# Altium project Master_Test_Board.PrjPcb
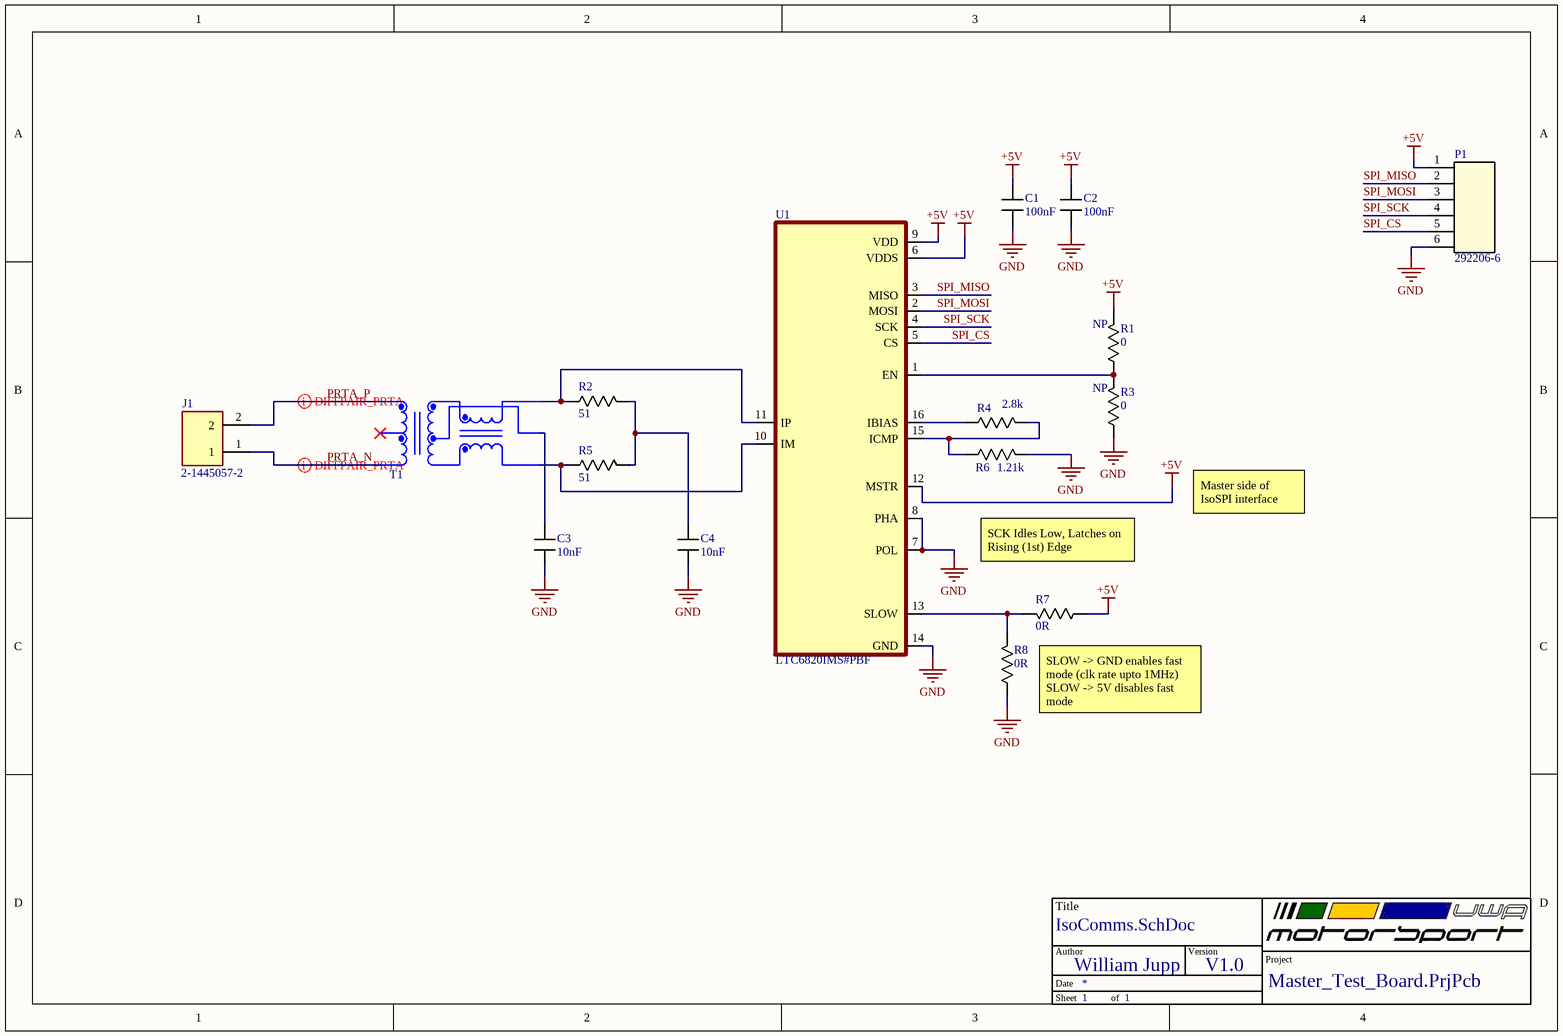
[diagram p0: IsoComms.SchDoc]
ProAuthor: William Jupp; Version: V1.0
1 sheet, 17 parts. Net scope: global (net labels, ports and power ports of the same name join across sheets).

## Sheet IsoComms.SchDoc
size A4; SheetNumber: 1; SheetTotal: 1

### Parts
*  UWAM Title block  (value not drawn)  (graphical)
C1  value 100nF  [C_0603]  (hidden comment: C)
C2  value 100nF  [C_0603]  (hidden comment: C)
C3  value 10nF  [C_0603]  (hidden comment: C)
C4  value 10nF  [C_0603]  (hidden comment: C)
J1  2-1445057-2  [2-1445057-2]
P1  292206-6  [292206-6]
R1  NP  value 0  [R-0603]
R2  value 51  [R-0603]  (hidden comment: Resistor)
R3  NP  value 0  [R-0603]
R4  value 2.8k  [R-0603]  (hidden comment: RB1)
R5  value 51  [R-0603]  (hidden comment: Resistor)
R6  value 1.21k  [R-0603]  (hidden comment: Resistor)
R7  value 0R  [0402]  (hidden comment: Resistor)
R8  value 0R  [0402]  (hidden comment: Resistor)
T1  SM91502ALE  [SM91502ALE]  (value not drawn)
U1  LTC6820IMS#PBF  [MSOP-16_MS]

### Nets
+5V: C1.2 C2.2 P1.1 R1.2 R7.1 U1.6(VDDS) U1.9(VDD) U1.12(MSTR)
GND: C1.1 C2.1 C3.1 C4.1 P1.6 R3.1 R6.1 R8.1 U1.7(POL) U1.8(PHA) U1.14(GND)
PRTA_N: J1.1 T1.3
PRTA_P: J1.2 T1.1
SPI_CS: P1.5 U1.5(CS)
SPI_MISO: P1.2 U1.3(MISO)
SPI_MOSI: P1.3 U1.2(MOSI)
SPI_SCK: P1.4 U1.4(SCK)
NetC3_2: C3.2 T1.5
NetC4_2: C4.2 R2.1 R5.2
NetR1_1: R1.1 R3.2 U1.1(EN)
NetR2_2: R2.2 T1.6 U1.11(IP)
NetR4_1: R4.1 R6.2 U1.15(ICMP)
NetR4_2: R4.2 U1.16(IBIAS)
NetR5_1: R5.1 T1.4 U1.10(IM)
NetR7_2: R7.2 R8.2 U1.13(SLOW)

Not connected (* = marked no-connect by the designer): T1 2*

### Layout directives
differential pair; differential pair class PRTA; rule Differential Pairs Routing [Pref Gap = 0.4mm    Min Gap  = 0.254mm    Max Gap  = 0.5mmPref Width = 0.2mm    Min Width  = 0.1mm    Max Width  = 0.381mm]: PRTA_P
differential pair; differential pair class PRTA: PRTA_N

### Notes on the sheet
- Master side of IsoSPI interface
- SCK Idles Low, Latches on Rising (1st) Edge
- SLOW -> GND enables fast mode (clk rate upto 1MHz)
  SLOW -> 5V disables fast mode
- (in symbol UWAM Title block) Title; Author; Version; Project; Date; Sheet; of

### Library data of the parts
C1-C4 = Capacitor: ComponentLink1Description: New link; ComponentLink1URL: *
J1 = 2-1445057-2: Conn Power HDR 2 POS 3mm Solder RA SMD 2 Terminal 1 Port; Manufacturer: TE Connectivity; Number of Terminals/Pins: 2; Connector Type: Pin; Mating Retention: Yes (With); Current Rating: 5A; Max Voltage Rating (AC): 250V; Number of Ports: 1; Contact Retention: No (Without); PCB Mount Retention: With; PCB Mounting Orientation: Right Angle; Connector System: Wire-to-Board; VDE Tested: Yes; Contact Resistance: 20mR; Insulation Resistance: 1GR; Pitch: 0.118inch; Plating Thickness: 2.54um; PCB Thickness: 0.062mm; Approvals: UL; Supplier 1: Digi-Key; RoHS: Yes; Category: Power Connectors; Stock 1: 16227; Pricing 1: 1=0.90000, 10=0.79300, 100=0.68410 (USD); Mount: Surface Mount; Contact Plating: Tin; Color: Black; Contact Material: Brass; Housing Material: Nylon; Housing Color: Black; Material: Nylon; Min Operating Temperature: -40°C; Max Operating Temperature: 221°C; Packaging: Tape and Reel; Package Quantity: 215; Termination: SMD/SMT; Number of Rows: 1; Number of Positions: 2; Number of Contacts: 2; Orientation: Right Angle; Fastening Type: Ramp; Series: Micro MATE-N-LOK; Contact Type: Male Pin; Mating Alignment: Yes (With); Contact Current Rating: 5A; Contact Gender: Male; Circuit Application: Power; Number of Power Positions: 2; Sealable: No (Without); Voltage Rating: 250V; Strain Relief: No (Without); Voltage Rating (AC): 250V; Length: 10mm; Depth: 11.16mm; Lead Pitch: 3mm; Radiation Hardening: No; Flammability Rating: UL94 V-0; RoHS Compliant: Yes; REACH SVHC: Unknown; ComponentLink1URL: https://datasheet.ciiva.com/1113/eng-cd-1445057-c1-1113056.pdf?src-supplier=Element14; ComponentLink1Description: https://datasheet.ciiva.com/1113/eng-cd-1445057-c1-1113056.pdf?src-supplier=Element14; ComponentLink2URL: https://datasheet.ciiva.com/16303/eng-cs-82181-softshell-high-density-0508-16303401.pdf?src-supplier=Future+Electronics; ComponentLink2Description: https://datasheet.ciiva.com/16303/eng-cs-82181-softshell-high-density-0508-16303401.pdf?src-supplier=Future+Electronics; ComponentLink3URL: https://datasheet.ciiva.com/11755/0900766b804da73b-11755230.pdf?src-supplier=RSComponents; ComponentLink3Description: https://datasheet.ciiva.com/11755/0900766b804da73b-11755230.pdf?src-supplier=RSComponents; ComponentLink4URL: https://datasheet.ciiva.com/46391/1444132-46391973.pdf?src-supplier=Element14; ComponentLink4Description: https://datasheet.ciiva.com/46391/1444132-46391973.pdf?src-supplier=Element14; ComponentLink5URL: https://datasheet.ciiva.com/726/eng-cd-1445057-c1-726999.pdf?src-supplier=Digi-Key; ComponentLink5Description: https://datasheet.ciiva.com/726/eng-cd-1445057-c1-726999.pdf?src-supplier=Digi-Key; ComponentLink6URL: https://datasheet.ciiva.com/709/eng-cd-1445057-c1-709819.pdf?src-supplier=Digi-Key; ComponentLink6Description: https://datasheet.ciiva.com/709/eng-cd-1445057-c1-709819.pdf?src-supplier=Digi-Key; ComponentLink7URL: https://datasheet.ciiva.com/16655/eng-cs-82181-softshell-high-density-0408-16655115.pdf?src-supplier=Avnet+Europe; ComponentLink7Description: https://datasheet.ciiva.com/16655/eng-cs-82181-softshell-high-density-0408-16655115.pdf?src-supplier=Avnet+Europe; ComponentLink8URL: https://datasheet.ciiva.com/709/eng-cd-1445057-c1-709820.pdf?src-supplier=Digi-Key; ComponentLink8Description: https://datasheet.ciiva.com/709/eng-cd-1445057-c1-709820.pdf?src-supplier=Digi-Key; ComponentLink9URL: https://datasheet.ciiva.com/3126/eng-cs-82181-softshell-high-density-0408-3126134.pdf?src-supplier=Avnet; ComponentLink9Description: https://datasheet.ciiva.com/3126/eng-cs-82181-softshell-high-density-0408-3126134.pdf?src-supplier=Avnet; ComponentLink10URL: https://datasheet.ciiva.com/15173/getdatasheetpartid-47438-15173642.pdf?src-supplier=Verical; ComponentLink10Description: https://datasheet.ciiva.com/15173/getdatasheetpartid-47438-15173642.pdf?src-supplier=Verical; ComponentLink11URL: https://datasheet.ciiva.com/30129/eng-cs-82181-softshell-high-density-0508-30129007.pdf?src-supplier=Onlinecomponents.com; ComponentLink11Description: https://datasheet.ciiva.com/30129/eng-cs-82181-softshell-high-density-0508-30129007.pdf?src-supplier=Onlinecomponents.com; Supplier Part Number 1: A33212CT-ND; Manufacturer Part Number: 2-1445057-2
P1 = 292206-6: AMP Mini CT, PCB Mount Header, Right Angle, Wire-to-Board, 6 Position, 1.5mm [.059in] Centerline, 1 Row, Tin, Natural Housing Color, Shrouded; ComponentLink1Description: Manufacturer Link; ComponentLink1URL: https://www.te.com/usa-en/product-292206-6.html; Part Number: 292206-6
R1 R3 R4 = Resistor
R6 = Resistor: RB2
T1 = SM91502ALE: BMS XFORMER 1-CH 1000V AECQ +125; Manufacturer: Bourns; Inductance: 150uH; Turns Ratio: 1:1; Supplier 1: RSComponents; Manufacturer Part Number: SM91502ALE; RoHS: Yes; Category: Transformers; Stock 1: 1; Pricing 1: 800=2.35100 (USD); Mount: Surface Mount; Min Operating Temperature: -40°C; Max Operating Temperature: 125°C; Packaging: Cut Tape; ComponentLink1URL: https://www.bourns.com/docs/Product-Datasheets/SM91502AL.pdf?src-supplier=Digi-Key; ComponentLink1Description: https://www.bourns.com/docs/Product-Datasheets/SM91502AL.pdf?src-supplier=Digi-Key; Supplier Part Number 1: 1802382
U1 = LTC6820HMS#PBF: IC COMM INTERFACE ISOSPI 16MSOP; Manufacturer: Analog Devices / Linear Technology; MF: {'manufacturer': u'Analog Devices Inc.'}; Interface: SPI; Min Supply Voltage: 2.7V; Max Supply Voltage: 5.5V; Availability: Unavailable; Price: None; Package: None; MP: LTC6820HMS#PBF; Value: *; Supplier 1: Mouser; Manufacturer Part Number: LTC6820HMS#PBF; RoHS: Yes; Category: Interface ICs; Pricing 1: 1=6.860000, 10=6.160000, 25=5.820000, 50=5.820000, 100=5.040000, 1000=4.780000, 10000=4.780000 (USD); Case/Package: MSOP; Number of Pins: 16; Min Operating Temperature: -40°C; Max Operating Temperature: 125°C; Package Quantity: 37; Packaging: Rail/Tube; Series: isoSPI; REACH SVHC: No SVHC; RoHS Compliant: Yes; ComponentLink1URL: https://datasheet.ciiva.com/22649/1730562-22649441.pdf?src-supplier=Element14; ComponentLink1Description: https://datasheet.ciiva.com/22649/1730562-22649441.pdf?src-supplier=Element14; ComponentLink2URL: https://datasheet.ciiva.com/6573/42317-6573703.pdf?src-supplier=Digi-Key; ComponentLink2Description: https://datasheet.ciiva.com/6573/42317-6573703.pdf?src-supplier=Digi-Key; ComponentLink3URL: https://datasheet.ciiva.com/22767/1730562-22767675.pdf?src-supplier=Farnell; ComponentLink3Description: https://datasheet.ciiva.com/22767/1730562-22767675.pdf?src-supplier=Farnell; Supplier Part Number 1: 584-LTC6820HMS#PBF